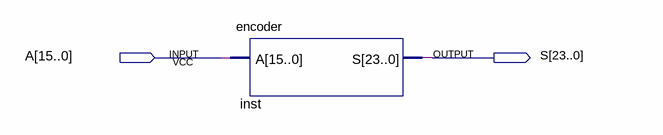
[diagram p0: schematic sheet]
// Quartus schematic encoder.bdf as structural Verilog: 1 symbols, 2 pins
module encoder (
  input  [15:0] A,
  output [23:0] S
);

  encoder inst (.A(A), .S(S));
endmodule
